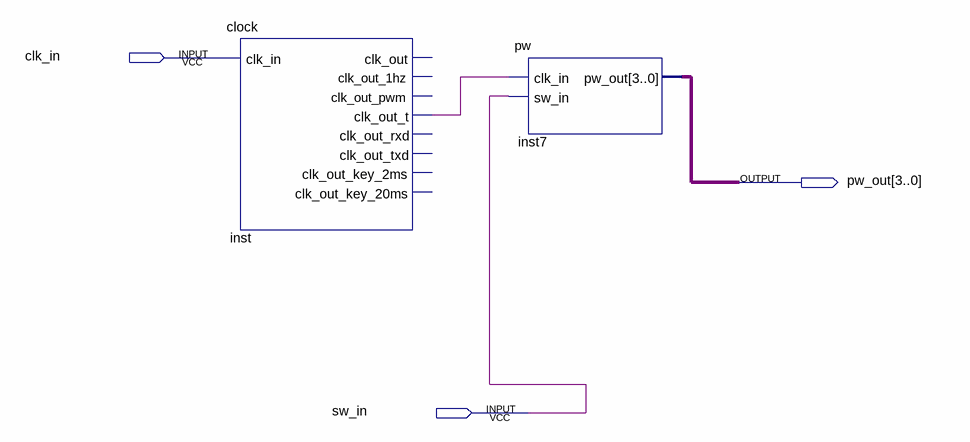
[diagram p0: schematic sheet]
// Quartus schematic pw_bdf.bdf as structural Verilog: 2 symbols, 3 pins
module pw_bdf (
  input  clk_in,
  input  sw_in,
  output [3:0] pw_out
);

  wire inst_clk_out_t;

  clock inst (
    .clk_in(clk_in), .clk_out_t(inst_clk_out_t));  // open: clk_out, clk_out_1hz, clk_out_pwm, clk_out_rxd, clk_out_txd, clk_out_key_2ms, clk_out_key_20ms
  pw inst7 (.clk_in(inst_clk_out_t), .sw_in(sw_in), .pw_out(pw_out));
endmodule
